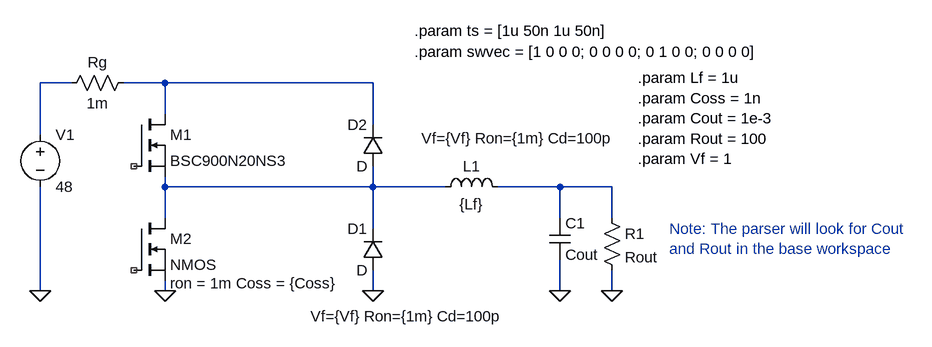
[diagram p0: schematic Buck.asc]
Buck.asc, the LTspice schematic file:
Version 4
SHEET 1 1524 680
WIRE -176 16 -224 16
WIRE -32 16 -96 16
WIRE 288 16 -32 16
WIRE -32 64 -32 16
WIRE 288 80 288 16
WIRE -224 96 -224 16
WIRE -32 176 -32 160
WIRE 288 176 288 144
WIRE 288 176 -32 176
WIRE 400 176 288 176
WIRE 576 176 480 176
WIRE 656 176 576 176
WIRE -32 224 -32 176
WIRE 576 224 576 176
WIRE 656 224 656 176
WIRE 288 240 288 176
WIRE -224 336 -224 176
WIRE -32 336 -32 320
WIRE 288 336 288 304
WIRE 576 336 576 288
WIRE 656 336 656 304
FLAG -32 336 0
FLAG -224 336 0
FLAG 576 336 0
FLAG 656 336 0
FLAG 288 336 0
SYMBOL nmos -80 64 R0
SYMATTR InstName M1
SYMATTR Value BSC900N20NS3
SYMBOL nmos -80 224 R0
WINDOW 123 56 100 Left 2
SYMATTR Value2 ron = 1m Coss = {Coss}
SYMATTR InstName M2
SYMBOL voltage -224 80 R0
WINDOW 123 0 0 Left 0
WINDOW 39 0 0 Left 0
SYMATTR InstName V1
SYMATTR Value 48
SYMBOL ind 384 192 R270
WINDOW 0 32 56 VTop 2
WINDOW 3 5 56 VBottom 2
SYMATTR InstName L1
SYMATTR Value {Lf}
SYMBOL cap 560 224 R0
SYMATTR InstName C1
SYMATTR Value Cout
SYMBOL res 640 208 R0
SYMATTR InstName R1
SYMATTR Value Rout
SYMBOL diode 304 304 R180
WINDOW 0 24 64 Left 2
WINDOW 3 24 0 Left 2
WINDOW 123 -185 -71 Left 2
SYMATTR InstName D1
SYMATTR Value2 Vf={Vf} Ron={1m} Cd=100p
SYMBOL res -80 0 R90
WINDOW 0 0 56 VBottom 2
WINDOW 3 32 56 VTop 2
SYMATTR InstName Rg
SYMATTR Value 1m
SYMBOL diode 304 144 R180
WINDOW 0 24 64 Left 2
WINDOW 3 24 0 Left 2
WINDOW 123 -356 43 Left 2
SYMATTR InstName D2
SYMATTR Value2 Vf={Vf} Ron={1m} Cd=100p
TEXT 696 8 Left 2 !.param Lf = 1u\n.param Coss = 1n\n.param Cout = 1e-3\n.param Rout = 100\n.param Vf = 1
TEXT 352 -64 Left 2 !.param ts = [1u 50n 1u 50n]
TEXT 352 -32 Left 2 !.param swvec = [1 0 0 0; 0 0 0 0; 0 1 0 0; 0 0 0 0]
TEXT 744 240 Left 2 ;Note: The parser will look for Cout \nand Rout in the base workspace

The netlist it stands for:
* Buck.asc
M1 N002 NC_01 N003 N003 BSC900N20NS3
M2 N003 NC_02 0 0 NMOS ron = 1m Coss = {Coss}
V1 N001 0 48
L1 N003 N004 {Lf}
C1 N004 0 Cout
R1 N004 0 Rout
D1 0 N003 D Vf={Vf} Ron={1m} Cd=100p
Rg N002 N001 1m
D2 N003 N002 D Vf={Vf} Ron={1m} Cd=100p
.model D D
.lib standard.dio
.model NMOS NMOS
.model PMOS PMOS
.lib standard.mos
.param Lf = 1u
.param Coss = 1n
.param Cout = 1e-3
.param Rout = 100
.param Vf = 1
.param ts = [1u 50n 1u 50n]
.param swvec = [1 0 0 0; 0 0 0 0; 0 1 0 0; 0 0 0 0]
* Note: The parser will look for Cout
* and Rout in the base workspace
.backanno
.end